# EAGLE design Qwiic Glove (EAGLE 7.7.0)
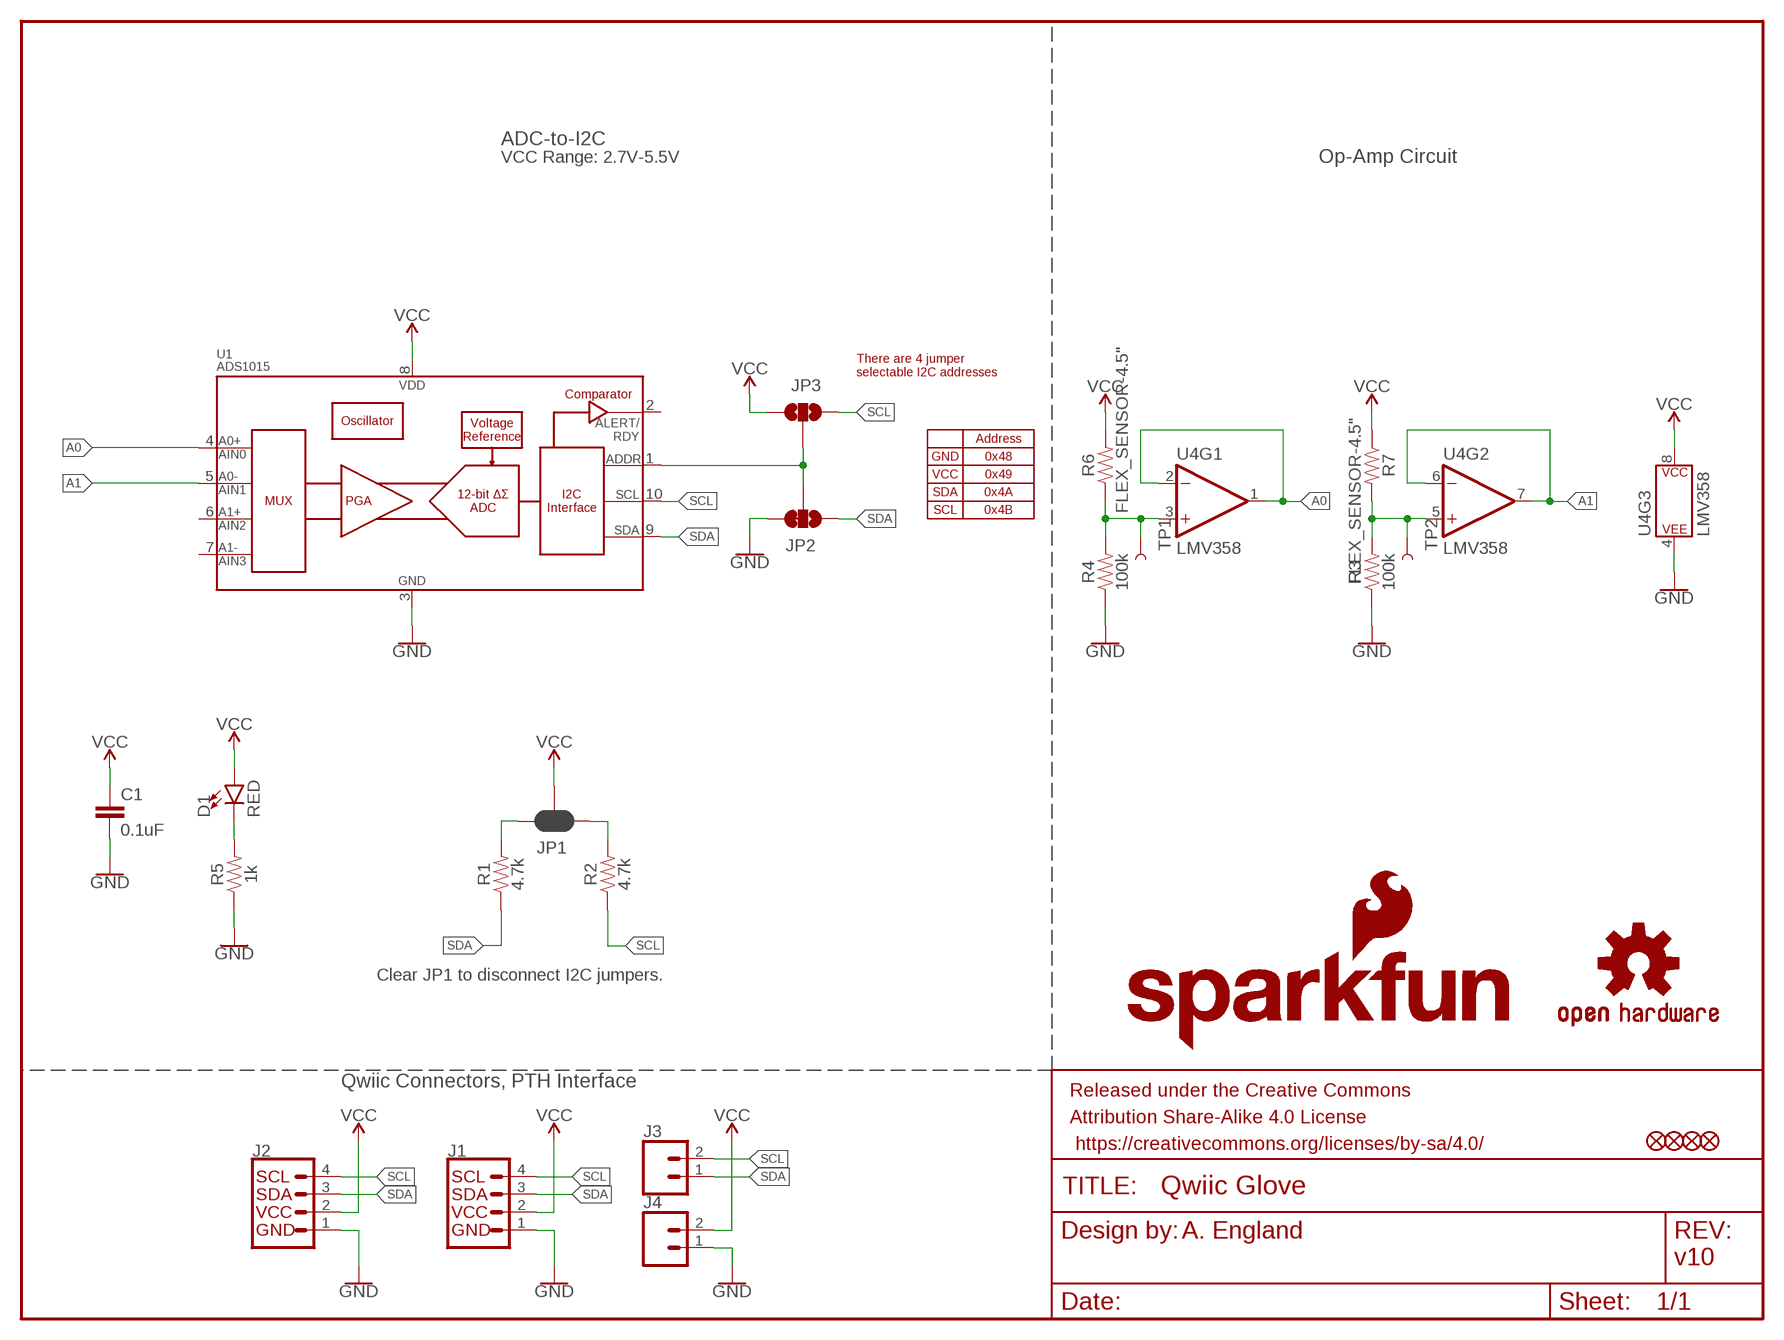
[diagram p0: schematic, sheet 1]

## Parts
C1  0.1uF  0.1UF-0603-25V-(+80/-20%)  [0603]
D1  RED  LED-RED0603  [LED-0603]
FD1  FIDUCIALUFIDUCIAL  [FIDUCIAL-MICRO]
FD2  FIDUCIALUFIDUCIAL  [FIDUCIAL-MICRO]
FD3  FIDUCIALUFIDUCIAL  [FIDUCIAL-MICRO]
FD4  FIDUCIALUFIDUCIAL  [FIDUCIAL-MICRO]
FRAME1  FRAME-LETTER  [CREATIVE_COMMONS]
J1  QWIIC_CONNECTORJS-1MM  [1X04_1MM_RA]
J2  QWIIC_CONNECTORJS-1MM  [1X04_1MM_RA]
J3  CONN_02  [1X02]
J4  CONN_02  [1X02]
JP1  JUMPER-SMT_3_2-NC_PASTE_NO-SILK  [SMT-JUMPER_3_2-NC_PASTE_NO-SILK]
JP2  JUMPER-SMT_3_1-NC_TRACE_NO-SILK  [SMT-JUMPER_3_1-NC_TRACE_NO-SILK]
JP3  JUMPER-SMT_3_NO_NO_SILK  [SMT-JUMPER_3_0-NO_TRACE_NO-SILK]
LOGO1  SFE_LOGO_NAME_FLAME.1_INCH  [SFE_LOGO_NAME_FLAME_.1]
LOGO2  OSHW-LOGOS  [OSHW-LOGO-S]
LOGO3  SFE_LOGO_FLAME.1_INCH  [SFE_LOGO_FLAME_.1]
R1  4.7k  4.7KOHM-0603-1/10W-1%  [0603]
R2  4.7k  4.7KOHM-0603-1/10W-1%  [0603]
R3  100k  100KOHM-0603-1/10W-1%  [0603]
R4  100k  100KOHM-0603-1/10W-1%  [0603]
R5  1k  1KOHM-0603-1/10W-1%  [0603]
R6  FLEX_SENSOR-4.5"  [FLEX_SENSOR]
R7  FLEX_SENSOR-4.5"  [FLEX_SENSOR]
TP1  TEST-POINT3  [PAD.03X.03]
TP2  TEST-POINT3  [PAD.03X.03]
U1  ADS1015  [MSOP10]
U4  LMV358  LMV358SOIC  [SO08]

## Nets
A0: U1.4(AIN0) U4.1(OUT) U4.2(-IN)
A1: U1.5(AIN1) U4.6(-IN) U4.7(OUT)
GND: C1.2 J1.1 J2.1 J4.1 JP2.3 R3.1 R4.1 R5.1 U1.3(VSS) U4.4(P$V-)
N$1: JP2.2 JP3.2 U1.1(ADDR)
N$2: D1.C R5.2
N$3: R3.2 R7.P$2 TP2.P$1 U4.5(+IN)
N$4: R4.2 R6.P$1 TP1.P$1 U4.3(+IN)
N$7: JP1.1 R2.2
N$8: JP1.3 R1.2
SCL: J1.4 J2.4 J3.2 JP3.3 R2.1 U1.10(SCL)
SDA: J1.3 J2.3 J3.1 JP2.1 R1.1 U1.9(SDA)
VCC: C1.1 D1.A J1.2 J2.2 J4.2 JP1.2 JP3.1 R6.P$2 R7.P$1 U1.8(VDD) U4.8(P$V+)
Unconnected: U1.2(ALERT/RDY) U1.6(AIN2) U1.7(AIN3)

## Notes on the sheet
- ADC-to-I2C
- VCC Range: 2.7V-5.5V | Op-Amp Circuit
- There are 4 jumper 
  selectable I2C addresses
- Address
- GND | 0x48
- VCC | 0x49
- SDA | 0x4A
- SCL | 0x4B
- Clear JP1 to disconnect I2C jumpers.
- Qwiic Connectors, PTH Interface
- A. England
- v10

## Library data of the parts
C1 = SparkFun-Capacitors:0.1UF: 0.1µF ceramic capacitors A capacitor is a passive two-terminal electrical component used to store electrical energy temporarily in an electric field.; PROD_ID: CAP-00810
D1 = SparkFun-LED:LED-RED: Red SMD LED Used in manufacturing of most products at SparkFun Packages: 0603 - SMD 0603 package [Product Link] <http://docs.avagotech.com/docs/AV02-0551EN> 0603 SMART - SMD 0603 SMART package ( more efficient and expensive)[Product Link] <http://www.osram-os.com/Graphics/XPic2/00077099_0.pdf> 1206 - SMD1206 package [Product Link] <https://www.sparkfun.com/datasheets/DevTools/LilyPad/Q150OVS4.pdff> SparkFun Products: Pro Mini 328 -5V <https://www.sparkfun.com/products/821> RedBoard <https://www.sparkfun.com/products/12757> IOIO-OTG <https://www.sparkfun.com/products/13613>; PROD_ID: DIO-00819
FD1-FD4 = SparkFun-Aesthetics:FIDUCIAL: Fiducial Alignment Points Point-of-reference for pick-and-place machines and other optical instruments.
FRAME1 = SparkFun-Aesthetics:FRAME-LETTER: Schematic Frame - Letter Standard 8.5x11 US Letter frame
J1 J2 = SparkFun-Connectors:QWIIC_CONNECTOR: SparkFun I2C Standard Qwiic Connector An SMD 1mm pitch JST connector makes it easy and quick (get it? Qwiic?) to connect I2C devices to each other. The Qwiic system <http://www.sparkfun.com/qwiic> enables fast and solderless connection between popular platforms and various sensors and actuators. We carry 200mm <https://www.sparkfun.com/products/14204>, 100mm <https://www.sparkfun.com/products/14205>, 50mm <https://www.sparkfun.com/products/14206>, and breadboard friendly <https://www.sparkfun.com/products/14207> Qwiic cables. We also offer 10 pcs strips <https://www.sparkfun.com/products/14323> the SMD connectors.; PROD_ID: CONN-13694
J3 J4 = SparkFun-Connectors:CONN_02: Multi connection point. Often used as Generic Header-pin footprint for 0.1 inch spaced/style header connections On any of the 0.1 inch spaced packages, you can populate with these: Break Away Headers - Straight <https://www.sparkfun.com/products/116> (PRT-00116) Break Away Male Headers - Right Angle <https://www.sparkfun.com/products/553> (PRT-00553) Female Headers <https://www.sparkfun.com/products/115> (PRT-00115) Break Away Headers - Machine Pin <https://www.sparkfun.com/products/117> (PRT-00117) Break Away Female Headers - Swiss Machine Pin <https://www.sparkfun.com/products/743> (PRT-00743) For SCREWTERMINALS and SPRING TERMINALS visit here: Screw Terimnals on SparkFun.com <https://www.sparkfun.com/search/results?term=Screw+Terminals> (5mm/3.5mm/2.54mm spacing) This device is also useful as a general connection point to wire up your design to another part of your project. Our various solder wires solder well into these plated through hole pads. Hook-Up Wire - Assortment (Stranded, 22 AWG) <https://www.sparkfun.com/products/11375> (PRT-11375) Hook-Up Wire - Assortment (Solid Core, 22 AWG) <https://www.sparkfun.com/products/11367> (PRT-11367) View the entire wire category on our website here <https://www.sparkfun.com/categories/141> Special notes: Molex polarized connector foot print use with: PRT-08233 with associated crimp pins and housings. 2.54_SCREWTERM for use with PRT-10571. 3.5mm Screw Terminal footprints for PRT-08084 5mm Screw Terminal footprints for use with PRT-08432
JP1 = SparkFun-Jumpers:JUMPER-SMT_3_2-NC_PASTE: Normally closed solder jumper (2 of 2 connections) This jumper has an aperture in the stencil to allow solder paste to bridge both connections. Both connections are normally closed (NC). Wick off the solder to open the connection(s). Reapply solder to reclose the connection(s).
JP2 = SparkFun-Jumpers:JUMPER-SMT_3_1-NC_TRACE: Normally closed trace jumper (1 of 2 connections) This jumper has a trace between two pads so it's normally closed (NC). The other connection is normally open (NO). Use a razor knife to open the connection. For best results follow the IPC guidelines for cutting traces: Cutout at least 0.063 mm (0.005 in). Remove all loose material to clean up the cut area. Seal the cut with an approved epoxy. Reapply solder to reclose the connection, or to close the NO connection.
JP3 = SparkFun-Jumpers:JUMPER-SMT_3_NO: Normally open jumper This jumper has three pads in close proximity to each other. Apply solder to close the connection(s).
LOGO1 = SparkFun-Aesthetics:SFE_LOGO_NAME_FLAME: SparkFun Font Logo w/ Flame This is the SparkFun full logo. The logo on the schematic will always be the same size; the package variant is the height of the flame part of the logo. Default layer for the logo on the board is tSilk.
LOGO2 = SparkFun-Aesthetics:OSHW-LOGO: Open-Source Hardware (OSHW) Logo This logo indicates the piece of hardware it is found on incorporates a OSHW license and/or adheres to the definition of open source hardware found here: http://freedomdefined.org/OSHW
LOGO3 = SparkFun-Aesthetics:SFE_LOGO_FLAME: SparkFun Flame Logo This is the SparkFun flame logo. The logo on the schematic will always be the same size; the package variant is the height of the flame. Default layer for the logo on the board is tSilk.
R1 R2 = SparkFun-Resistors:4.7KOHM: 4.7kΩ resistor A resistor is a passive two-terminal electrical component that implements electrical resistance as a circuit element. Resistors act to reduce current flow, and, at the same time, act to lower voltage levels within circuits. - Wikipedia; PROD_ID: RES-07857
R3 R4 = SparkFun-Resistors:100KOHM: 100kΩ resistor A resistor is a passive two-terminal electrical component that implements electrical resistance as a circuit element. Resistors act to reduce current flow, and, at the same time, act to lower voltage levels within circuits. - Wikipedia; PROD_ID: RES-07828
R5 = SparkFun-Resistors:1KOHM: 1kΩ resistor A resistor is a passive two-terminal electrical component that implements electrical resistance as a circuit element. Resistors act to reduce current flow, and, at the same time, act to lower voltage levels within circuits. - Wikipedia; PROD_ID: RES-07856
R6 R7 = SparkFun-Resistors:FLEX_SENSOR: Spectra Symbol Flex Sensor (2.2", 4.5") - A flexible resistor that changes its resistance as it bends. A footpring for the 2.2" and 4.5" flex sensors that allows them to be attached to PCB for more durabiility SparkFun Products: 4.5" Flex Sensor <https://www.sparkfun.com/products/8606> 2.2" Flex Sensor <https://www.sparkfun.com/products/10264>; PROD_ID: COMP-13078
TP1 TP2 = SparkFun-Connectors:TEST-POINT: SparkFun Test Points Bare copper test points for troubleshooting or In-Circuit-Testing. These are used by our Production team for verifying production board runs using pogo-pins on test beds. SparkFun Products: SparkFun LSM9DS1 Breakout <https://www.sparkfun.com/products/13284> SparkFun PSOC <https://www.sparkfun.com/products/13714> SparkFun Load Cell Amplifier <https://www.sparkfun.com/products/13879>
U1 = SparkFun-IC-Conversion:ADS1015: ADS1015 12-BIT ADC 12-Bit Del-Sig ADC Four single-ended inputs or two differential inputs Internal PGA I2C interface 2.0-5.5V SparkFun Products SparkFun Block for Intel Edison - ADC <https://www.sparkfun.com/products/13770> (DEV-13770); PROD_ID: IC-12270
U4 = SparkFun-IC-Amplifiers:LMV358: IC LMV358 DUAL OP AMP Jellybean rail-to-rail output op-amp SparkFun Products SparkFun PicoBoard <https://www.sparkfun.com/products/11888> (WIG-11888) SparkFun Vernier Interface Shield <https://www.sparkfun.com/products/12858> (DEV-12858) SparkFun Blynk Board - ESP8266 <https://www.sparkfun.com/products/13794> (WRL-13794) SparkFun Digital Sandbox <https://www.sparkfun.com/products/12651> (DEV-12651 RoHS); PROD_ID: IC-09657

## Board
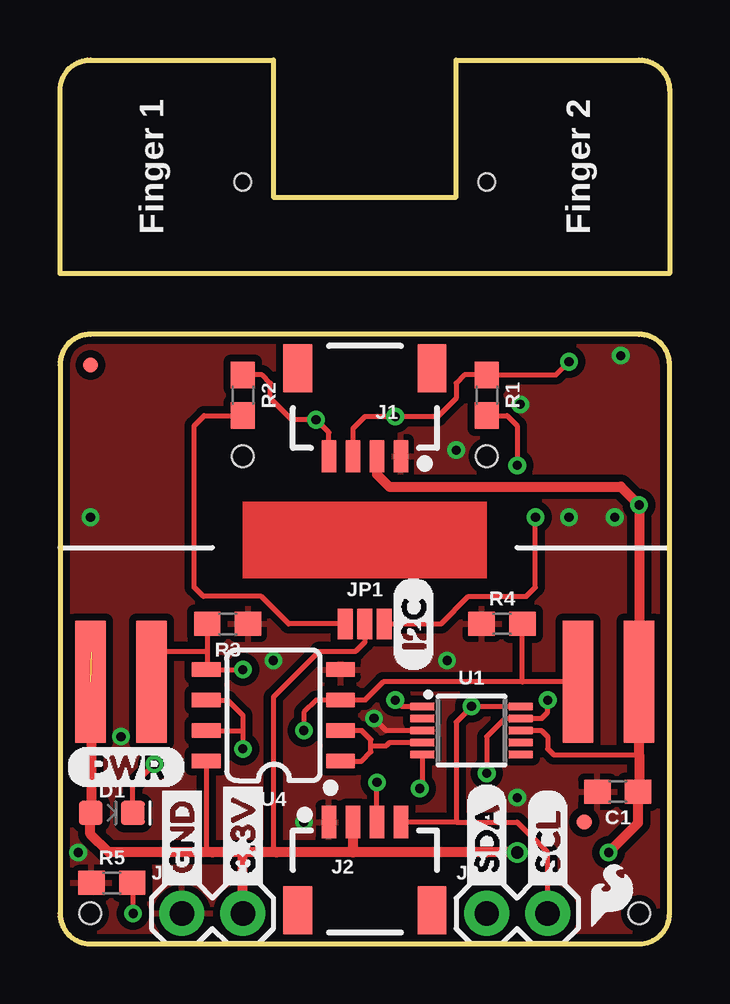
[diagram p1: board, top side]
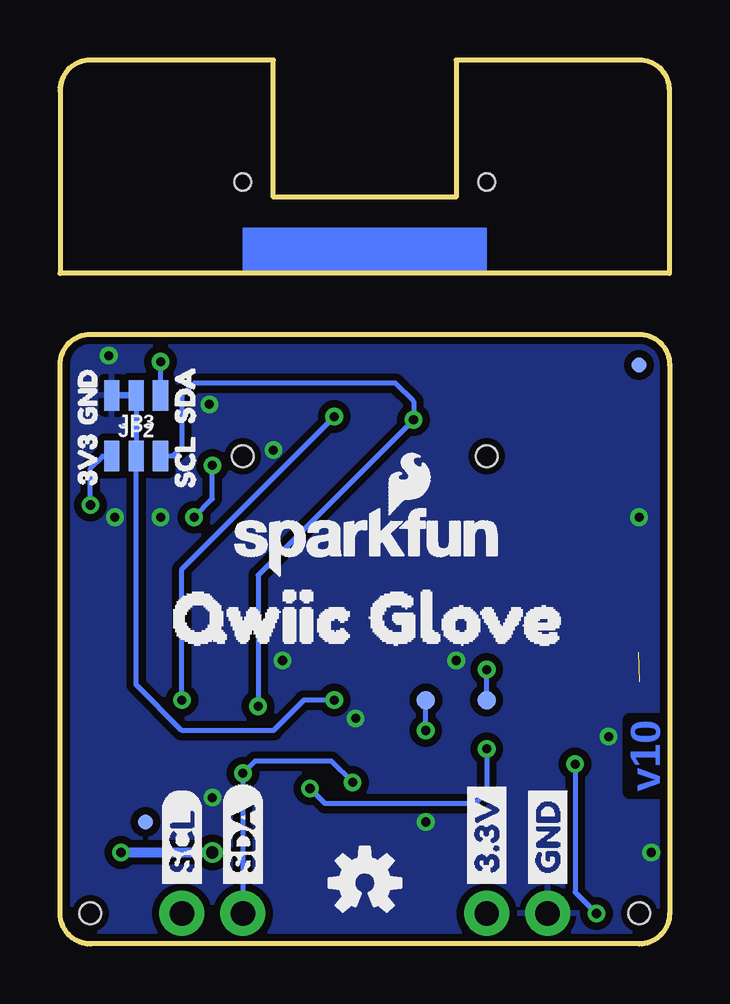
[diagram p2: board, bottom side, seen from below]

Size 25.4 x 36.83 mm. Coordinates in mm from the lower left corner, seen from the top.
Outline: 1.27,0 24.13,0 arc90 25.4,1.27 25.4,24.13 arc90 24.13,25.4 1.27,25.4 arc90 0,24.13 0,1.27 arc90 1.27,0
Outline: 0,27.94 0,35.56 arc-90 1.27,36.83 8.89,36.83 8.89,31.11 16.51,31.11 16.51,36.83 24.13,36.83 arc-90 25.4,35.56 25.4,27.94 0,27.94
Copper layers (1*16): Top 0.035mm / dielectric 1.5mm / Bottom 0.035mm
Design rules "SparkFun-2-layer-TIGHT": minimum track width 7mil, minimum drill 15mil, track to track 7mil, track to pad 7mil, pad to pad 7mil, via to via 7mil, smd to smd 7mil, copper to edge 7mil, drill to drill 7mil, minimum pad ring 7mil, minimum via ring 7mil, stop-mask expansion 4mil, vias tented up to drill 25mil, thermal gap 10mil
Holes 0.9 mm at 7.62,20.32 17.78,20.32 1.27,1.27 24.13,1.27
Holes 0.7 mm at 7.62,31.75 17.78,31.75

### Footprints (pad centres in the part's own frame; a part is rotated, then mirrored left to right if it is on the bottom)
0603 = smd 1.1 x 1: 1 -0.85,0; 2 0.85,0
LED-0603 = smd 1 x 1: A -0.877,0; C 0.877,0
FIDUCIAL-MICRO = smd 0.635 x 0.635: 1 0,0
1X04_1MM_RA = smd 0.6 x 1.35: 1 -1.5,0; 2 -0.5,0; 3 0.5,0; 4 1.5,0 | smd 1.2 x 2: NC1 2.8,-3.675; NC2 -2.8,-3.675
1X02 = drill 1.016 pad 1.88: 1 0,0; 2 2.54,0
SMT-JUMPER_3_2-NC_PASTE_NO-SILK = smd 0.635 x 1.27: 1 -0.813,0; 2 0,0; 3 0.813,0
SMT-JUMPER_3_1-NC_TRACE_NO-SILK = smd 0.635 x 1.27: 1 -1.016,0; 2 0,0; 3 1.016,0
SMT-JUMPER_3_0-NO_TRACE_NO-SILK = smd 0.635 x 1.27: 1 -1.016,0; 2 0,0; 3 1.016,0
FLEX_SENSOR = smd 1.27 x 5.08: P$1 -1.27,-1.27; P$2 1.27,-1.27
PAD.03X.03 = smd 0.762 x 0.762: P$1 0,0
MSOP10 = smd 0.3 x 1: 1 -1,-2.05; 2 -0.5,-2.05; 3 0,-2.05; 4 0.5,-2.05; 5 1,-2.05; 6 1,2.05; 7 0.5,2.05; 8 0,2.05; 9 -0.5,2.05; 10 -1,2.05
SO08 = smd 0.6 x 1.2: 1 -1.905,-2.8; 2 -0.635,-2.8; 3 0.635,-2.8; 4 1.905,-2.8; 5 1.905,2.8; 6 0.635,2.8; 7 -0.635,2.8; 8 -1.905,2.8

### Placement (x,y rotation side)
C1  23.24,6.35 180 top
D1  2.16,5.46 0 top
FD1  21.84,5.08 0 top
FD2  21.84,5.08 0 bottom
FD3  1.27,24.13 0 top
FD4  1.27,24.13 0 bottom
FRAME1  -11.43,-10.16 0 top  (outside the outline)
J1  12.7,20.32 180 top
J2  12.7,5.08 0 top
J3  17.78,1.27 0 top
J4  5.08,1.27 0 top
JP1  12.7,13.34 0 top
JP2  22.23,22.86 180 bottom
JP3  22.23,20.32 0 bottom
LOGO1  18.54,15.24 0 bottom
LOGO2  12.7,2.54 0 bottom
LOGO3  21.84,0.38 0 top
R1  17.78,22.86 270 top
R2  7.62,22.86 270 top
R3  6.99,13.34 180 top
R4  18.41,13.34 0 top
R5  2.16,2.54 0 top
R6  22.86,12.19 0 top
R7  2.54,12.19 0 top
TP1  10.16,10.16 0 bottom
TP2  7.62,10.16 0 bottom
U1  17.14,8.89 270 top
U4  8.89,9.53 90 top
U$1  [GND]  5.08,2.03 90 top
U$2  [GND]  5.08,2.03 90 bottom
U$3  [3V3-TEXT]  24.26,18.41 90 bottom
U$4  [GND-TEXT-03]  24.26,20.95 90 bottom
U$5  [3.3V]  7.62,2.03 90 top
U$6  [3.3V]  7.62,2.03 90 bottom
U$7  [SDA]  17.78,2.03 90 top
U$8  [SDA]  17.78,2.03 90 bottom
U$9  [SCL]  20.32,2.03 90 top
U$10  [SCL]  20.32,2.03 90 bottom
U$11  [(PWR)]  0.25,7.37 0 top
U$12  [SDA0]  20.19,20.95 90 bottom
U$13  [SCL2]  20.19,18.29 90 bottom
U$14  [QWIIC_GLOVE1]  22.61,13.59 0 bottom
U$15  [I2C-()]  14.73,11.3 90 top

### Tracks (layer width: path | path; a pad name or v marks a point on that pad's centre or on a via)
A0
  Top 0.203: U4.1 12.57,7.62 12.95,8 12.95,8.26 | 12.95,8.26 12.95,8.51 12.57,8.89 U4.2 | 12.95,8.26 13.59,8.26 13.72,8.39 U1.4
A1  (via drill 0.38)
  Top 0.203: 7.62,8.89 7.62,9.53 6.99,10.16 U4.6 | 7.62,8.89 v7.62,8.13 | U4.7 7.62,8.89 | 15.04,6.53 v14.99,6.48 15.1,6.59 U1.5
  Bottom 0.203: v14.99,6.48 14.35,5.84 8.13,5.84 7.62,6.35 v7.62,8.13
GND  (via drill 0.38)
  Top 0.203: v13.08,9.4 13.59,8.89 U1.3
  other vias: 8.89,11.81 10.16,5.08 16.13,11.81 2.54,8.64 1.27,17.78 21.21,17.78 19.05,6.1 19.18,22.48 16.51,20.57 0.76,3.81 23.11,17.78 23.37,24.51
  pour Bottom (isolate 0.305): 0,1.27 arc90 1.27,0 24.13,0 arc90 25.4,1.27 25.4,24.13 arc90 24.13,25.4 1.27,25.4 arc90 0,24.13
  pour Top (isolate 0.305): 25.4,1.27 arc-90 24.13,0 1.27,0 arc-90 0,1.27 0,24.13 arc-90 1.27,25.4 24.13,25.4 arc-90 25.4,24.13
N$1  (via drill 0.38)
  Top 0.203: U1.1 14.24,9.89 v13.97,10.16
  Bottom 0.203: JP2.2 JP3.2 22.23,10.79 20.32,8.89 16.51,8.89 15.24,10.16 v13.97,10.16
N$2  (via drill 0.38)
  Top 0.203: v3.05,1.27 3.05,2.5 R5.2 | D1.C 3.04,6.59 v3.94,7.49
  Bottom 0.203: v3.94,7.49 3.94,2.16 v3.05,1.27
N$3  (via drill 0.38)
  Top 0.203: R3.2 6.13,12.19 | 6.13,12.19 6.13,11.47 U4.5 v7.62,11.43 | R7.P$2 3.81,12.19 6.13,12.19
  Bottom 0.203: TP2.P$1 v7.62,11.43
N$4  (via drill 0.38)
  Top 0.203: 19.27,10.92 R4.2 | 19.27,10.92 13.46,10.92 12.7,10.16 U4.3 10.67,10.16 10.16,9.65 v10.16,8.89 | R6.P$1 19.27,10.92
  Bottom 0.203: v10.16,8.89 TP1.P$1
N$7
  Top 0.203: JP1.1 9.53,13.34 8.38,14.48 5.97,14.48 5.59,14.86 5.59,21.59 6.01,22.01 R2.2
N$8  (via drill 0.38)
  Top 0.203: JP1.3 15.88,13.34 17.02,14.48 19.43,14.48 19.81,14.86 v19.81,17.78 | R1.2 18.63,22.01 19.05,21.59 v19.05,19.94
  Bottom 0.203: v19.81,17.78 19.05,18.54 v19.05,19.94
SCL  (via drill 0.38)
  Top 0.203: J1.4 11.2,21.31 v10.67,21.84 9.65,21.84 8.76,22.73 8.76,23.37 8.42,23.71 R2.1 | 17.16,9.89 16.51,9.24 16.51,5.08 | J3.2 20.32,3.81 19.05,5.08 16.51,5.08 | 16.51,5.08 J2.4 | U1.10 17.16,9.89 | 17.16,9.89 v17.14,9.91
  Bottom 0.203: v17.14,9.91 17.14,15.37 v10.67,21.84 10.67,22.61 11.43,23.37 19.81,23.37 20.32,22.86 20.32,20.7 20.7,20.32 JP3.3
SDA  (via drill 0.38)
  Top 0.203: J1.3 12.2,21.47 12.7,21.97 v13.97,21.97 15.75,21.97 16.51,22.73 16.51,23.37 16.85,23.71 R1.1 20.66,23.71 v21.21,24.26 | J2.3 v13.2,6.72 v13.21,6.73 | v20.32,10.16 20.32,9.65 20.06,9.39 U1.9 18.53,9.39 17.78,8.64 v17.78,7.11
  Bottom 0.203: v13.21,6.73 14.1,7.62 17.27,7.62 v17.78,7.11 J3.1 | v20.32,10.16 20.32,15.62 v13.97,21.97 | JP2.1 v21.21,24.26
VCC  (via drill 0.38, 0.51)  (1 unrouted)
  Top 0.203: 9.02,3.81 8.89,3.94 8.89,10.29 10.79,12.19 12.32,12.19 12.7,12.57 JP1.2 | 18.29,3.81 17.78,3.81 | 24.13,7.87 20.57,7.87 20.32,8.13 20.32,8.64 20.07,8.89 U1.8 | U4.8 6.09,3.81 6.35,3.81
  Top 0.406: v19.05,3.81 17.78,3.81 12.2,3.81 | 12.2,3.81 9.02,3.81 7.62,3.81 | 7.62,3.81 6.35,3.81 2.03,3.81 1.27,4.57 1.27,5.68 1.28,5.68 D1.A 1.31,5.49 1.31,12.15 | J2.2 12.2,3.81 | J1.2 13.2,19.57 13.72,19.05 23.37,19.05 v24.13,18.29 R6.P$2 24.13,7.87 24.13,6.35 C1.1 24.09,5.04 v22.86,3.81 | J4.2 7.62,3.81
  Bottom 0.203: v24.13,18.29 24.13,19.81 23.62,20.32 JP3.1
  Bottom 0.406: v22.86,3.81 v19.05,3.81
(copper drawn outside any net)
  shapes: Bottom area x1, Top area x1

### Text on the board
Bottom: v10
tPlace: Finger 1 | Finger 2
Measures: Units in Inches
tDocu: Andy England